# Altium schematic sheet Potencia.SchDoc
size A4
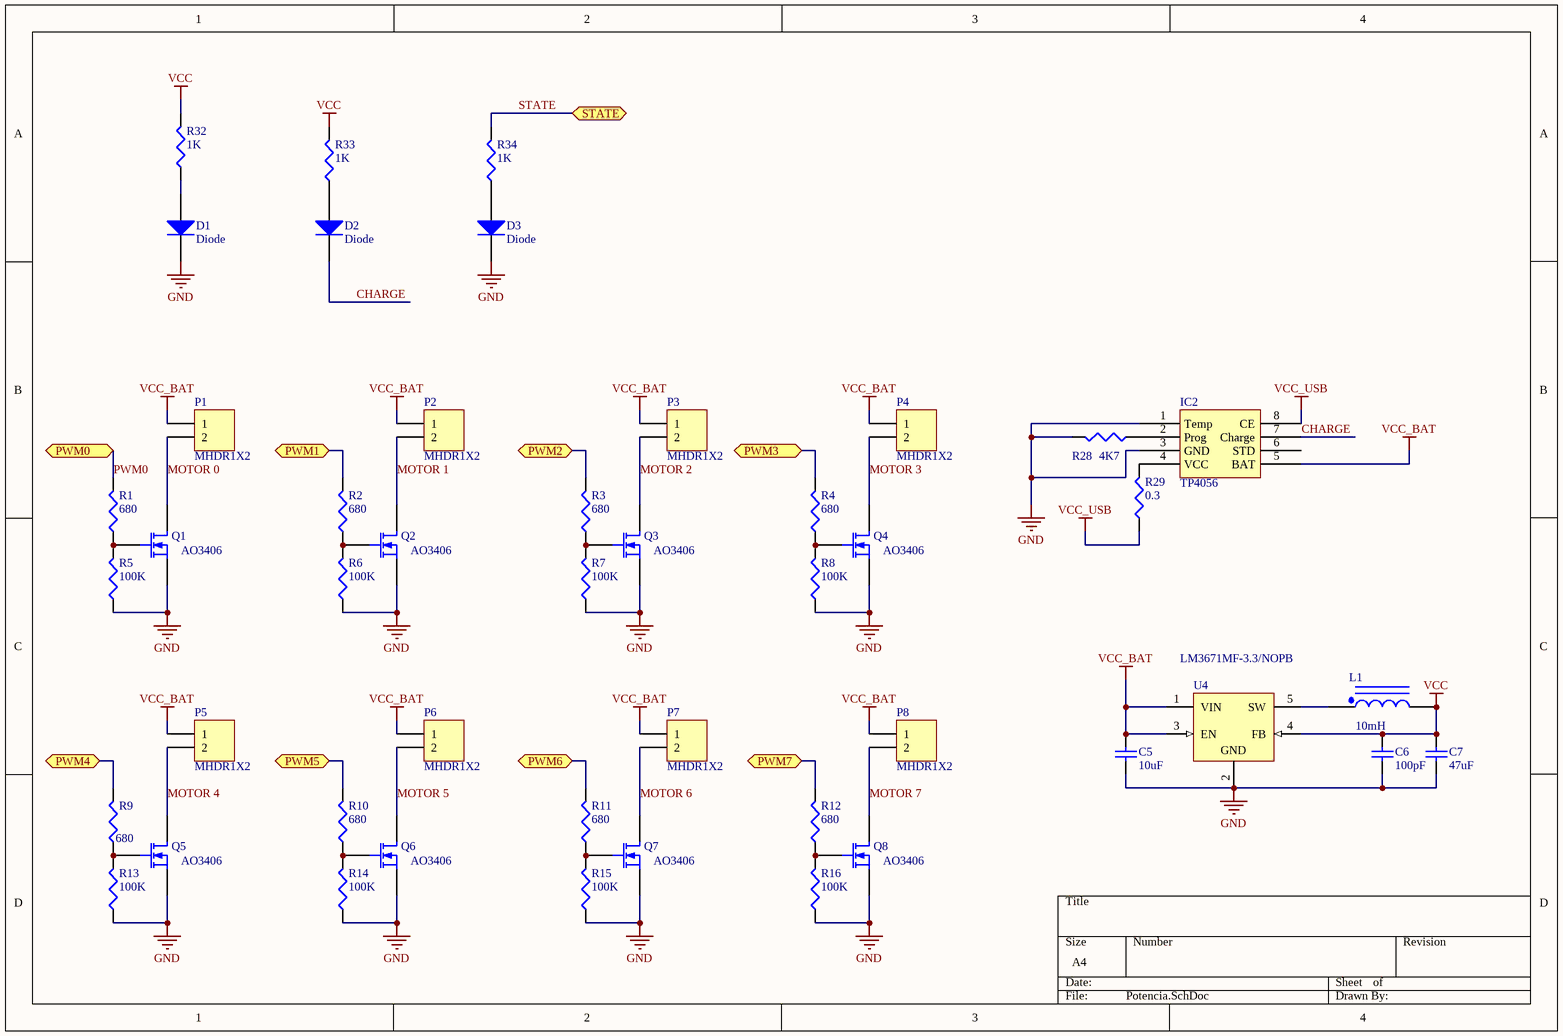
[diagram p0: Potencia.SchDoc]

## Parts
C5  value 10uF  [6-0805_L]  (hidden comment: Cap)
C6  value 100pF  [6-0805_L]  (hidden comment: Cap)
C7  value 47uF  [6-0805_L]  (hidden comment: Cap)
D1  Diode  [LED-0805]
D2  Diode  [LED-0805]
D3  Diode  [LED-0805]
IC2  TP4056  [SOIC127P600X175-8AN]
L1  value 10mH  [Inductor CD43]  (hidden comment: Inductor Iron Dot)
P1  MHDR1X2  [MHDR1X2]
P2  MHDR1X2  [MHDR1X2]
P3  MHDR1X2  [MHDR1X2]
P4  MHDR1X2  [MHDR1X2]
P5  MHDR1X2  [MHDR1X2]
P6  MHDR1X2  [MHDR1X2]
P7  MHDR1X2  [MHDR1X2]
P8  MHDR1X2  [MHDR1X2]
Q1  AO3406  [SOT23-3]
Q2  AO3406  [SOT23-3]
Q3  AO3406  [SOT23-3]
Q4  AO3406  [SOT23-3]
Q5  AO3406  [SOT23-3]
Q6  AO3406  [SOT23-3]
Q7  AO3406  [SOT23-3]
Q8  AO3406  [SOT23-3]
R1  value 680  [6-0805_N]  (hidden comment: Res3)
R2  value 680  [6-0805_N]  (hidden comment: Res3)
R3  value 680  [6-0805_N]  (hidden comment: Res3)
R4  value 680  [6-0805_N]  (hidden comment: Res3)
R5  value 100K  [6-0805_N]  (hidden comment: Res3)
R6  value 100K  [6-0805_N]  (hidden comment: Res3)
R7  value 100K  [6-0805_N]  (hidden comment: Res3)
R8  value 100K  [6-0805_N]  (hidden comment: Res3)
R9  value 680  [6-0805_N]  (hidden comment: Res3)
R10  value 680  [6-0805_N]  (hidden comment: Res3)
R11  value 680  [6-0805_N]  (hidden comment: Res3)
R12  value 680  [6-0805_N]  (hidden comment: Res3)
R13  value 100K  [6-0805_N]  (hidden comment: Res3)
R14  value 100K  [6-0805_N]  (hidden comment: Res3)
R15  value 100K  [6-0805_N]  (hidden comment: Res3)
R16  value 100K  [6-0805_N]  (hidden comment: Res3)
R28  value 4K7  [6-0805_N]  (hidden comment: Res3)
R29  value 0.3  [C1206]  (hidden comment: Res3)
R32  value 1K  [6-0805_N]  (hidden comment: Res3)
R33  value 1K  [6-0805_N]  (hidden comment: Res3)
R34  value 1K  [6-0805_N]  (hidden comment: Res3)
U4  LM3671MF-3.3/NOPB  [MF05A_N]

## Ports
PWM0, PWM1, PWM2, PWM3, PWM4, PWM5, PWM6, PWM7, STATE

## Nets
GND: C5.1 C6.1 C7.1 D1.2(K) D3.2(K) IC2.1(Temp) IC2.3(GND) Q1.3(S) Q2.3(S) Q3.3(S) Q4.3(S) Q5.3(S) Q6.3(S) Q7.3(S) Q8.3(S) R5.1 R6.1 R7.1 R8.1 R13.1 R14.1 R15.1 R16.1 R28.2 U4.2(GND)
VCC: C6.2 C7.2 L1.2 R32.2 R33.2 U4.4(FB)
VCC_BAT: C5.2 IC2.5(BAT) P1.1 P2.1 P3.1 P4.1 P5.1 P6.1 P7.1 P8.1 U4.1(VIN) U4.3(EN)
VCC_USB: IC2.8(CE) R29.1
CHARGE: D2.2(K) IC2.7(Charge)
MOTOR 0: P1.2 Q1.1(D)
MOTOR 1: P2.2 Q2.1(D)
MOTOR 2: P3.2 Q3.1(D)
MOTOR 3: P4.2 Q4.1(D)
MOTOR 4: P5.2 Q5.1(D)
MOTOR 5: P6.2 Q6.1(D)
MOTOR 6: P7.2 Q7.1(D)
MOTOR 7: P8.2 Q8.1(D)
PWM0: R1.2 ; port PWM0
PWM1: R2.2 ; port PWM1
PWM2: R3.2 ; port PWM2
PWM3: R4.2 ; port PWM3
PWM4: R9.2 ; port PWM4
PWM5: R10.2 ; port PWM5
PWM6: R11.2 ; port PWM6
PWM7: R12.2 ; port PWM7
STATE: R34.2 ; port STATE
NetD1_1: D1.1(A) R32.1
NetD2_1: D2.1(A) R33.1
NetD3_1: D3.1(A) R34.1
NetIC2_2: IC2.2(Prog) R28.1
NetIC2_4: IC2.4(VCC) R29.2
NetL1_1: L1.1 U4.5(SW)
NetQ1_2: Q1.2(G) R1.1 R5.2
NetQ2_2: Q2.2(G) R2.1 R6.2
NetQ3_2: Q3.2(G) R3.1 R7.2
NetQ4_2: Q4.2(G) R4.1 R8.2
NetQ5_2: Q5.2(G) R9.1 R13.2
NetQ6_2: Q6.2(G) R10.1 R14.2
NetQ7_2: Q7.2(G) R11.1 R15.2
NetQ8_2: Q8.2(G) R12.1 R16.2

Not connected (* = marked no-connect by the designer): IC2 6(STD)

## Library data of the parts
C5-C7 = Cap: Capacitor; Published: 8-Jun-2000; LatestRevisionDate: 17-Jul-2002; LatestRevisionNote: Re-released for DXP Platform.; PackageReference: RAD-0.3; Publisher: Altium Limited; PackageDescription: Radial Cap, Thru-Hole; 2 Leads; 0.3 in Pin Spacing
D1-D3 = Diode: Default Diode; Published: 8-Jun-2000; LatestRevisionDate: 17-Jul-2002; LatestRevisionNote: Re-released for DXP Platform.; PackageVersion: Sep-1996; PackageReference: SMC; Publisher: Altium Limited; PackageDescription: DO-214-AB/SMC; 2 C-Bend Leads; Body 7.9 x 5.9 mm, inc. leads (LxW); Code_JEDEC: DO-214-AB
L1 = Inductor Iron Dot: Magnetic-Core Inductor with Winding Polarity Marking; Published: 24-Mar-1999; LatestRevisionDate: 17-Jul-2002; LatestRevisionNote: Re-released for DXP Platform.; PackageReference: DIODE_SMC; Publisher: Altium Limited; PackageDescription: Diode; 2 Leads
P1-P8 = MHDR1X2: Header, 2-Pin; LatestRevisionDate: 17-Jul-2002; LatestRevisionNote: Re-released for DXP Platform.; Publisher: Altium Limited
Q1-Q8 = MOSFET-N: N-Channel MOSFET; pin to pad: 1>3 2>1 3>2; Published: 8-Jun-2000; LatestRevisionDate: 17-Jul-2002; LatestRevisionNote: Re-released for DXP Platform.; PackageVersion: 1995/1996; PackageReference: E3; Publisher: Altium Limited; PackageDescription: TO, Flat Index; 3 In-Line, Axial Leads; Body Dia. 4.6mm; Lead Dia. 0.5 mm (max)
R1-R16 R28 R29 R32-R34 = Res3: Resistor; Published: 8-Jun-2000; LatestRevisionDate: 29-May-2009; LatestRevisionNote: IPC-7351 Footprint Added.; PackageReference: J1-0603; Publisher: Altium Limited; PackageDescription: Chip Resistor
U4 = LM3671MF-3.3/NOPB: 2MHz, 600mA Step-Down DC-DC Converter, 5-pin SOT-23, Pb-Free; Manufacturer: National Semiconductor; PackageTopMarking: SJEB*XTT; PowerWise: Y; CompType: MiscPower; Published: 1-Mar-2010; DatasheetVersion: Oct-2008; PackageVersion: revD, Aug-2008; PackageReference: MF05A; Publisher: Altium Limited; PackageDescription: Molded SOT-23, .115 x .063 x .040 in Body, 5 Lead, .0375 in Pitch; Supplier 1: Digi-Key; Supplier Part Number 1: LM3671MF-3.3TR-ND; Supplier 2: Digi-Key; Supplier Part Number 2: LM3671MF-3.3CT-ND; Supplier 3: Digi-Key; Supplier Part Number 3: LM3671MF-3.3DKR-ND; Supplier 4: Farnell; Supplier Part Number 4: 1685767; PartNumber: LM3671MF-3.3/NOPB; RoHS: Y; PinCount: 5; ComponentLink1Description: LM3671 Datasheet; ComponentLink1URL: http://www.national.com/ds/LM/LM3671.pdf; ComponentLink2Description: LM3671 Web Page; ComponentLink2URL: http://www.national.com/pf/LM/LM3671.html; ComponentLink3Description: MF05A Package Page; ComponentLink3URL: http://www.national.com/packaging/folders/mf05a.html